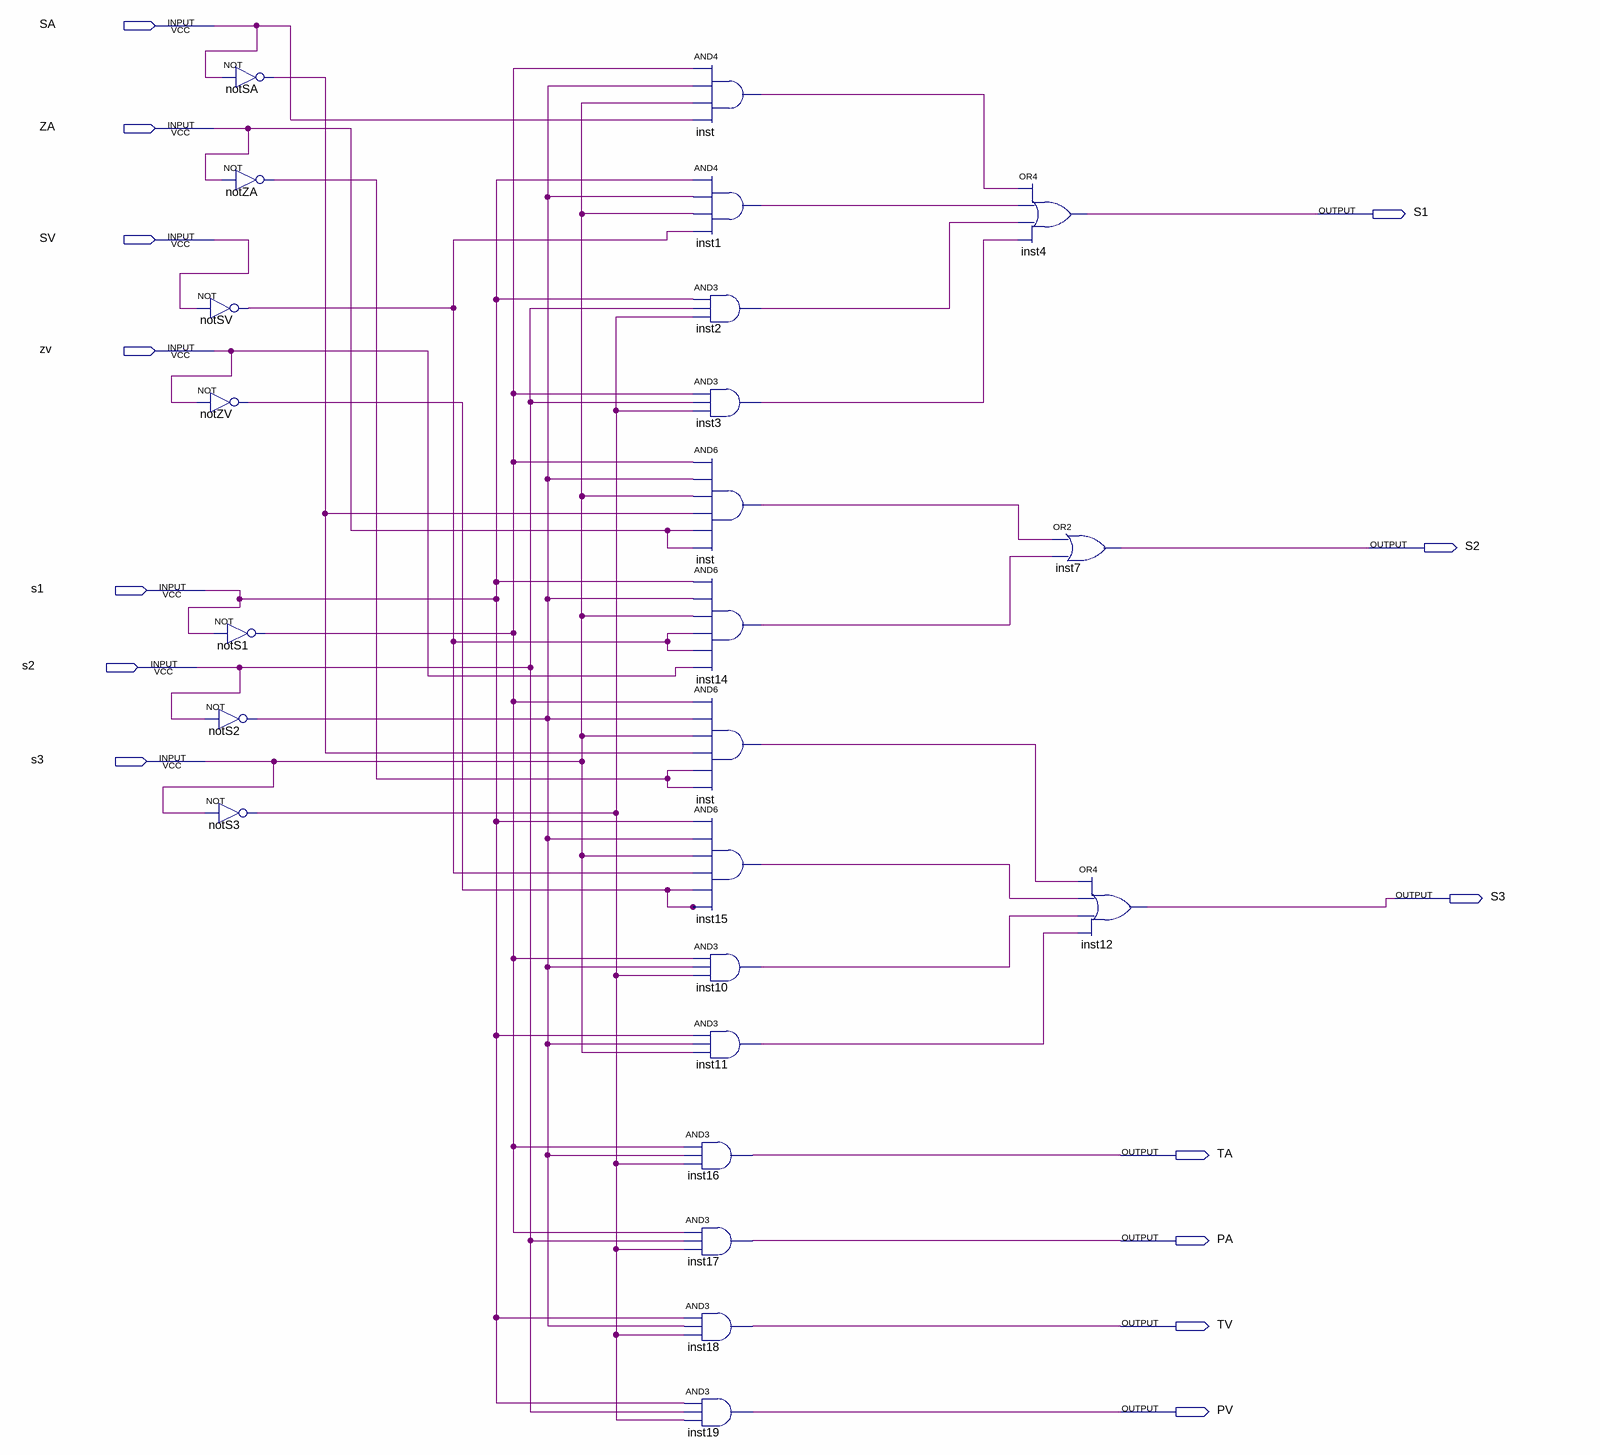
[diagram p0: schematic sheet]
// Quartus schematic marcapasso.bdf as structural Verilog: 24 symbols, 14 pins
module marcapasso (
  input  SA,
  input  ZA,
  input  SV,
  input  zv,
  inout  s1,
  inout  s2,
  inout  s3,
  output TA,
  output PA,
  output TV,
  output PV
);

  wire inst1_out, inst2_out, inst3_out, inst10_out, inst11_out, inst14_out, inst15_out, inst_out, inst_out_2,
       inst_out_3, notS1_out, notS2_out, notS3_out, notSA_out, notSV_out, notZA_out, notZV_out;

  not notSA (notSA_out, SA);
  not notZA (notZA_out, ZA);
  not notSV (notSV_out, SV);
  not notZV (notZV_out, zv);
  not notS1 (notS1_out, s1);
  not notS2 (notS2_out, s2);
  not notS3 (notS3_out, s3);
  and inst (inst_out, notS1_out, notS2_out, s3, SA);
  and inst1 (inst1_out, s1, notS2_out, s3, notSV_out);
  and inst2 (inst2_out, s1, s2, notS3_out);
  and inst3 (inst3_out, notS1_out, s2, notS3_out);
  and inst_dup2 (inst_out_2, notS1_out, notS2_out, s3, notSA_out, ZA, ZA);
  and inst14 (inst14_out, s1, notS2_out, s3, notSV_out, notSV_out, zv);
  and inst_dup3 (inst_out_3, notS1_out, notS2_out, s3, notSA_out, notZA_out, notZA_out);
  and inst15 (inst15_out, s1, notS2_out, s3, notSV_out, notZV_out, notZV_out);
  and inst10 (inst10_out, notS1_out, notS2_out, notS3_out);
  and inst11 (inst11_out, s1, notS2_out, s3);
  and inst16 (TA, notS1_out, notS2_out, notS3_out);
  and inst17 (PA, notS1_out, s2, notS3_out);
  and inst18 (TV, s1, notS2_out, notS3_out);
  and inst19 (PV, s1, s2, notS3_out);
  or inst4 (s1, inst_out, inst1_out, inst2_out, inst3_out);
  or inst7 (s2, inst_out_2, inst14_out);
  or inst12 (s3, inst_out_3, inst15_out, inst10_out, inst11_out);
endmodule
